# EAGLE schematic untitled (EAGLE 7.2.0)
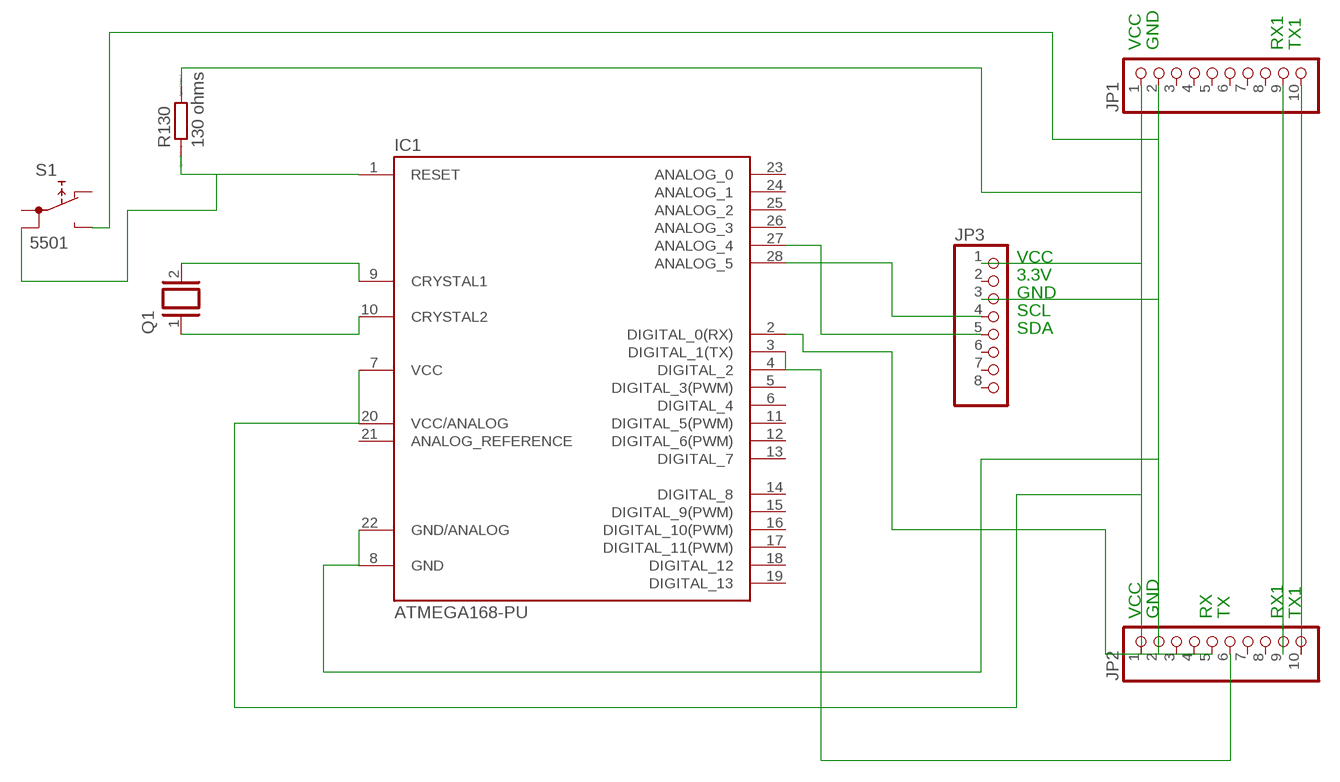
[diagram p0: schematic, sheet 1]

## Parts
IC1  ATMEGA168-PU  [DIL28-3]
JP1  PINHD-1X10  [1X10]
JP2  PINHD-1X10  [1X10]
JP3  PINHD-1X8  [1X08]
Q1  XTAL/S  [QS]
R130  130 ohms  R0204/7  [0204/7]
S1  5501  [5501]

## Nets
N$1: IC1.1(RESET) R130.1 S1.1B
N$2: IC1.7(VCC) IC1.20(VCC/ANALOG) JP1.1 JP2.1 JP3.1 R130.2
N$3: IC1.8(GND) IC1.22(GND/ANALOG) JP1.2 JP2.2 JP3.3 S1.NO
N$4: JP1.9 JP2.9
N$5: JP1.10 JP2.10
N$6: IC1.28(ANALOG_5) JP3.4
N$7: IC1.27(ANALOG_4) JP3.5
N$9: IC1.9(CRYSTAL1) Q1.2
N$10: IC1.10(CRYSTAL2) Q1.1
N$12: IC1.2(DIGITAL_0(RX)) JP2.5
N$13: IC1.3(DIGITAL_1(TX)) JP2.6
Unconnected: IC1.4(DIGITAL_2) IC1.5(DIGITAL_3(PWM)) IC1.6(DIGITAL_4) IC1.11(DIGITAL_5(PWM)) IC1.12(DIGITAL_6(PWM)) IC1.13(DIGITAL_7) IC1.14(DIGITAL_8) IC1.15(DIGITAL_9(PWM)) IC1.16(DIGITAL_10(PWM)) IC1.17(DIGITAL_11(PWM)) IC1.18(DIGITAL_12) IC1.19(DIGITAL_13) IC1.21(ANALOG_REFERENCE) IC1.23(ANALOG_0) IC1.24(ANALOG_1) IC1.25(ANALOG_2) IC1.26(ANALOG_3) JP1.3 JP1.4 JP1.5 JP1.6 JP1.7 JP1.8 JP2.3 JP2.4 JP2.7 JP2.8 JP3.2 JP3.6 JP3.7 JP3.8 S1.1A S1.NC

## Notes on the sheet
- VCC | GND | RX1 | TX1
- VCC
- 3.3V
- GND
- SCL
- SDA
- VCC | GND | RX | TX | RX1 | TX1

## Library data of the parts
IC1 = Arduino-AVR:ATMEGA168-PU
JP1 JP2 = pinhead:PINHD-1X10: PIN HEADER
JP3 = pinhead:PINHD-1X8: PIN HEADER
Q1 = special:XTAL/S: CRYSTAL
R130 = eagle-ltspice:R: RESISTOR, European symbol; SPICEMODEL: NONE; SPICEPREFIX: R
S1 = switch:55?: PUSHBUTTON SERIES 5500 SWITCHES Source: www.e-switch.com .. 5500.pdf